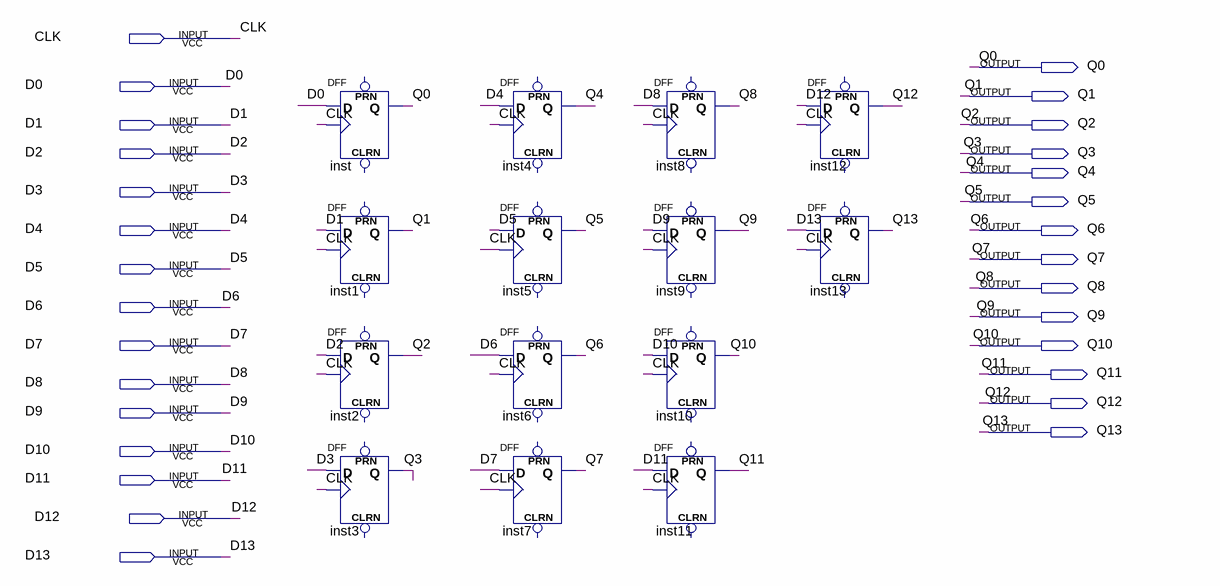
[diagram p0: schematic sheet]
// Quartus schematic IR.bdf as structural Verilog: 14 symbols, 29 pins
module IR (
  input  CLK,
  input  D0,
  input  D1,
  input  D2,
  input  D3,
  input  D4,
  input  D5,
  input  D6,
  input  D7,
  input  D8,
  input  D9,
  input  D10,
  input  D11,
  input  D12,
  input  D13,
  output Q0,
  output Q1,
  output Q2,
  output Q3,
  output Q4,
  output Q5,
  output Q6,
  output Q7,
  output Q8,
  output Q9,
  output Q10,
  output Q11,
  output Q12,
  output Q13
);

  DFF inst (.CLK(CLK), .D(D0), .Q(Q0));  // open: CLRN, PRN
  DFF inst1 (.CLK(CLK), .D(D1), .Q(Q1));  // open: CLRN, PRN
  DFF inst2 (.CLK(CLK), .D(D2), .Q(Q2));  // open: CLRN, PRN
  DFF inst3 (.CLK(CLK), .D(D3), .Q(Q3));  // open: CLRN, PRN
  DFF inst4 (.CLK(CLK), .D(D4), .Q(Q4));  // open: CLRN, PRN
  DFF inst5 (.CLK(CLK), .D(D5), .Q(Q5));  // open: CLRN, PRN
  DFF inst6 (.CLK(CLK), .D(D6), .Q(Q6));  // open: CLRN, PRN
  DFF inst7 (.CLK(CLK), .D(D7), .Q(Q7));  // open: CLRN, PRN
  DFF inst8 (.CLK(CLK), .D(D8), .Q(Q8));  // open: CLRN, PRN
  DFF inst9 (.CLK(CLK), .D(D9), .Q(Q9));  // open: CLRN, PRN
  DFF inst10 (.CLK(CLK), .D(D10), .Q(Q10));  // open: CLRN, PRN
  DFF inst11 (.CLK(CLK), .D(D11), .Q(Q11));  // open: CLRN, PRN
  DFF inst12 (.CLK(CLK), .D(D12), .Q(Q12));  // open: CLRN, PRN
  DFF inst13 (.CLK(CLK), .D(D13), .Q(Q13));  // open: CLRN, PRN
endmodule
